# EAGLE design EyeSpark (EAGLE 6.2)
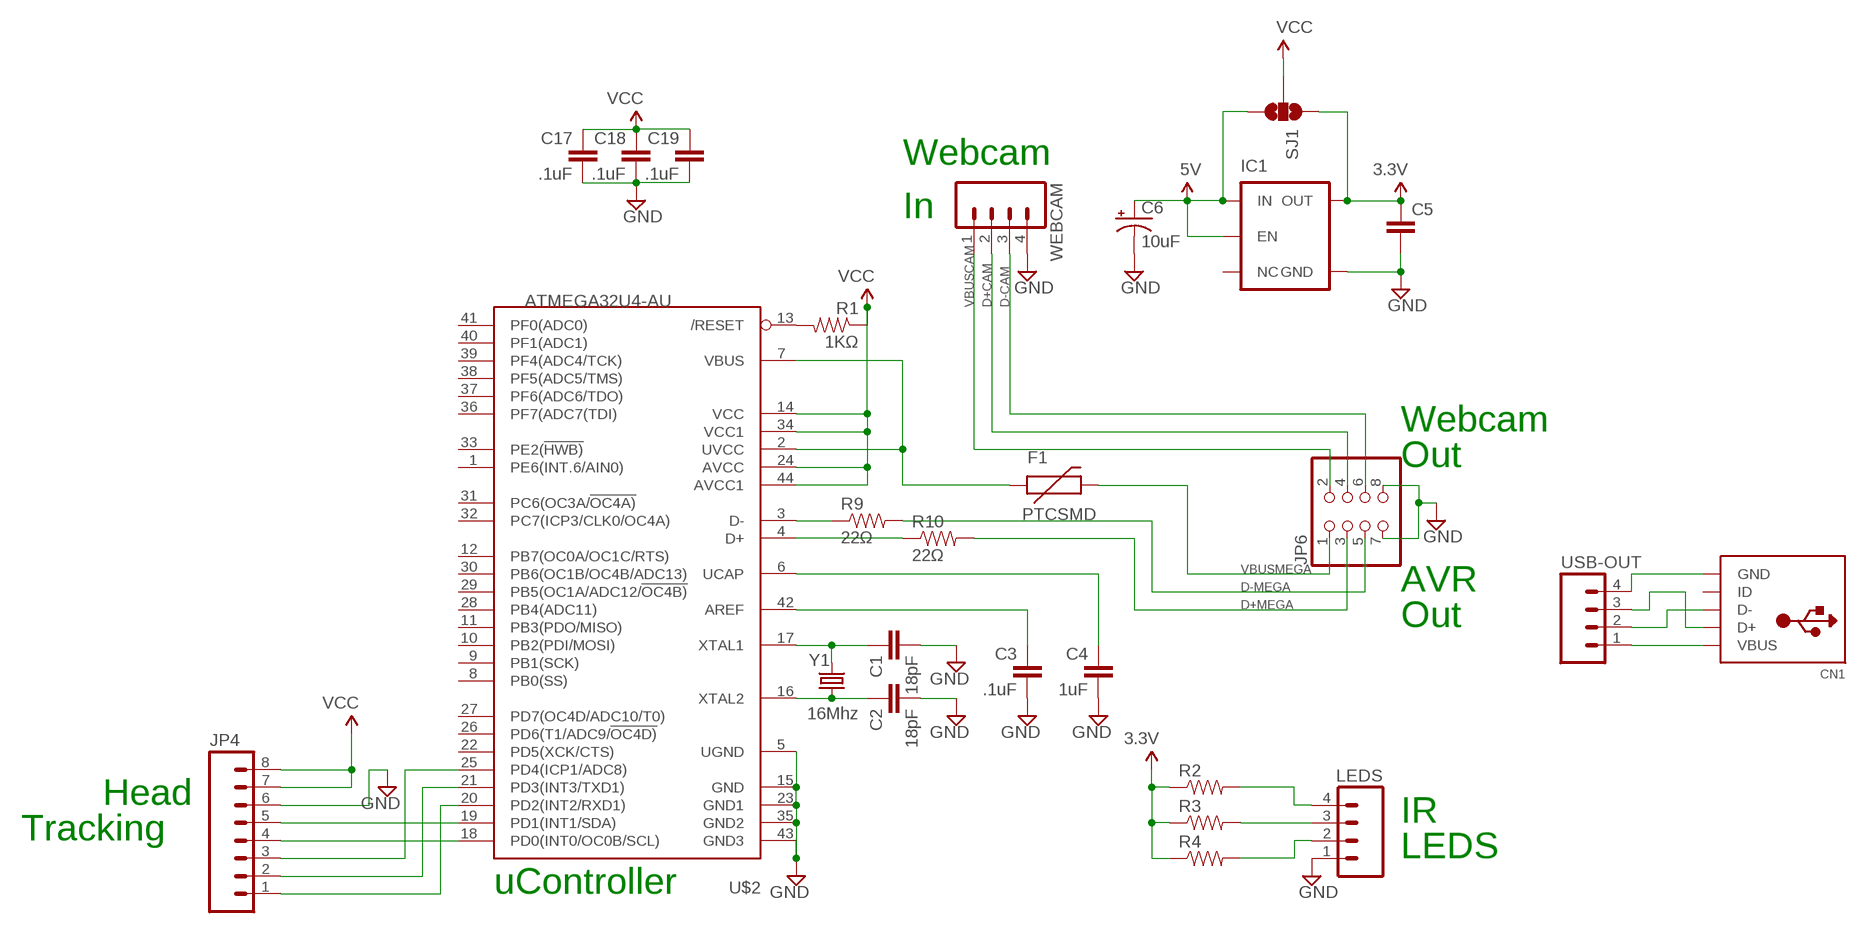
[diagram p0: schematic, sheet 1]

## Parts
C1  18pF  CAP0805  [0805]
C2  18pF  CAP0805  [0805]
C3  .1uF  CAP0805  [0805]
C4  1uF  CAP0805  [0805]
C5  CAP0805  [0805]
C6  10uF  CAP_POL7343  [EIA7343]
C17  .1uF  CAP0805  [0805]
C18  .1uF  CAP0805  [0805]
C19  .1uF  CAP0805  [0805]
CN1  USBMINIB  [USB-MINIB]
F1  PTCSMD  [PTC-1206]
IC1  V_REG_TPS76433SOT23-5  [SOT23-5]
JP4  M08LOCK  [1X08_LOCK]
JP6  PINHD-2X4  [2X04]
LEDS  M04PTH  [1X04]
R1  1KΩ  RESISTOR0805-RES  [0805]
R2  RESISTOR1206  [1206]
R3  RESISTOR1206  [1206]
R4  RESISTOR1206  [1206]
R9  22Ω  RESISTOR0805-RES  [0805]
R10  22Ω  RESISTOR0805-RES  [0805]
SJ1  SOLDERJUMPER_2WAYT  [SJ_2]
U$2  ATMEGA32U4-AU  [TQFP44]
USB-OUT  M04PTH  [1X04]
WEBCAM  M04LOCK_LONGPADS  [1X04_LOCK_LONGPADS]
Y1  16Mhz  CRYSTAL5X3  [CRYSTAL-SMD-5X3]

## Nets
3.3V: C5.1 IC1.5(OUT) R2.1 R3.1 R4.1 SJ1.1
5V: C6.A(+) IC1.1(IN) IC1.3(EN) SJ1.3
D+CAM: JP6.4 WEBCAM.2
D+MEGA: JP6.3 R10.2
D-CAM: JP6.6 WEBCAM.3
D-MEGA: JP6.5 R9.2
GND: C1.2 C2.2 C3.2 C4.2 C5.2 C6.C(-) C17.2 C18.2 C19.2 IC1.2(GND) JP4.6 JP6.7 JP6.8 LEDS.1 U$2.5(UGND) U$2.15(GND) U$2.23(GND1) U$2.35(GND2) U$2.43(GND3) WEBCAM.4
N$1: C3.1 U$2.42(AREF)
N$2: C4.1 U$2.6(UCAP)
N$3: R1.2 U$2.13(/RESET)
N$4: R9.1 U$2.3(D-)
N$5: R10.1 U$2.4(D+)
N$6: JP4.4 U$2.18(PD0(INT0/OC0B/SCL))
N$7: C2.1 U$2.16(XTAL2) Y1.3
N$8: C1.1 U$2.17(XTAL1) Y1.1
N$9: JP4.1 U$2.20(PD2(INT2/RXD1))
N$10: LEDS.4 R2.2
N$11: JP4.2 U$2.21(PD3(INT3/TXD1))
N$12: JP4.5 U$2.19(PD1(INT1/SDA))
N$13: JP4.3 U$2.25(PD4(ICP1/ADC8))
N$14: LEDS.3 R3.2
N$15: F1.1 U$2.2(UVCC) U$2.7(VBUS)
N$16: LEDS.2 R4.2
N$17: CN1.VBUS USB-OUT.1
N$19: CN1.GND USB-OUT.4
N$20: CN1.D- USB-OUT.2
N$21: CN1.D+ USB-OUT.3
VBUSCAM: JP6.2 WEBCAM.1
VBUSMEGA: F1.2 JP6.1
VCC: C17.1 C18.1 C19.1 JP4.7 JP4.8 R1.1 SJ1.2 U$2.14(VCC) U$2.24(AVCC) U$2.34(VCC1) U$2.44(AVCC1)
Unconnected: CN1.ID IC1.4(NC) U$2.1(PE6(INT.6/AIN0)) U$2.8(PB0(SS)) U$2.9(PB1(SCK)) U$2.10(PB2(PDI/MOSI)) U$2.11(PB3(PDO/MISO)) U$2.12(PB7(OC0A/OC1C/RTS)) U$2.22(PD5(XCK/CTS)) U$2.26(PD6(T1/ADC9/!OC4D)) U$2.27(PD7(OC4D/ADC10/T0)) U$2.28(PB4(ADC11)) U$2.29(PB5(OC1A/ADC12/!OC4B)) U$2.30(PB6(OC1B/OC4B/ADC13)) U$2.31(PC6(OC3A/!OC4A)) U$2.32(PC7(ICP3/CLK0/OC4A)) U$2.33(PE2(!HWB)) U$2.36(PF7(ADC7(TDI)) U$2.37(PF6(ADC6/TDO)) U$2.38(PF5(ADC5/TMS)) U$2.39(PF4(ADC4/TCK)) U$2.40(PF1(ADC1)) U$2.41(PF0(ADC0))

## Notes on the sheet
- Webcam
- In
- Webcam
- Out
- AVR
- Out
- Head
- IR
- Tracking
- LEDS
- uController

## Library data of the parts
C1-C5 C17-C19 = SparkFun:CAP: Capacitor Standard 0603 ceramic capacitor, and 0.1" leaded capacitor.
C6 = SparkFun:CAP_POL: Capacitor Polarized These are standard SMD and PTH capacitors. Normally 10uF, 47uF, and 100uF in electrolytic and tantalum varieties. Always verify the external diameter of the through hole cap, it varies with capacity, voltage, and manufacturer. The EIA devices should be standard.
CN1 = adafruit:USB: USB Connectors USBMINIB - Surface Mount Female Mini-B USB Connector 4UConnector: 06564 By microbuilder.eu Thru-hole RA Female Mini-B USB Connector 4UConnector: 18732 By ladyada.net
F1 = SparkFun:PTC: Resettable Fuse PTC Resettable Fuse. Spark Fun Electronics SKU : COM-08357
IC1 = SparkFun:V_REG_TPS76433: Voltage Regulator Older TI part. LDO 150mA regulator. No output by-pass cap option. See V_REG_LDO for a better part.
JP4 = SparkFun:M08: Header 8 Standard 8-pin 0.1" header. Use with straight break away headers (SKU : PRT-00116), right angle break away headers (PRT-00553), swiss pins (PRT-00743), machine pins (PRT-00117), and female headers (PRT-00115).
JP6 = adafruit:PINHD-2X4: PIN HEADER
LEDS USB-OUT WEBCAM = SparkFun:M04: Header 4 Standard 4-pin 0.1" header. Use with straight break away headers (SKU : PRT-00116), right angle break away headers (PRT-00553), swiss pins (PRT-00743), machine pins (PRT-00117), and female headers (PRT-00115). Molex polarized connector foot print use with SKU : PRT-08231 with associated crimp pins and housings. 1MM SMD Version SKU: PRT-10208
R1-R4 R9 R10 = SparkFun:RESISTOR: Resistor Basic schematic elements and footprints for 0603, 1206, and PTH resistors.
SJ1 = SparkFun:SOLDERJUMPER_2WAY: Solder Jumper 2 way solder jumper
U$2 = adafruit:ATMEGA32U4: http://www.ladyada.net/library/eagle
Y1 = SparkFun:CRYSTAL: Crystals Various standard crystals. Proven footprints. Spark Fun Electronics SKU : COM-00534

## Board
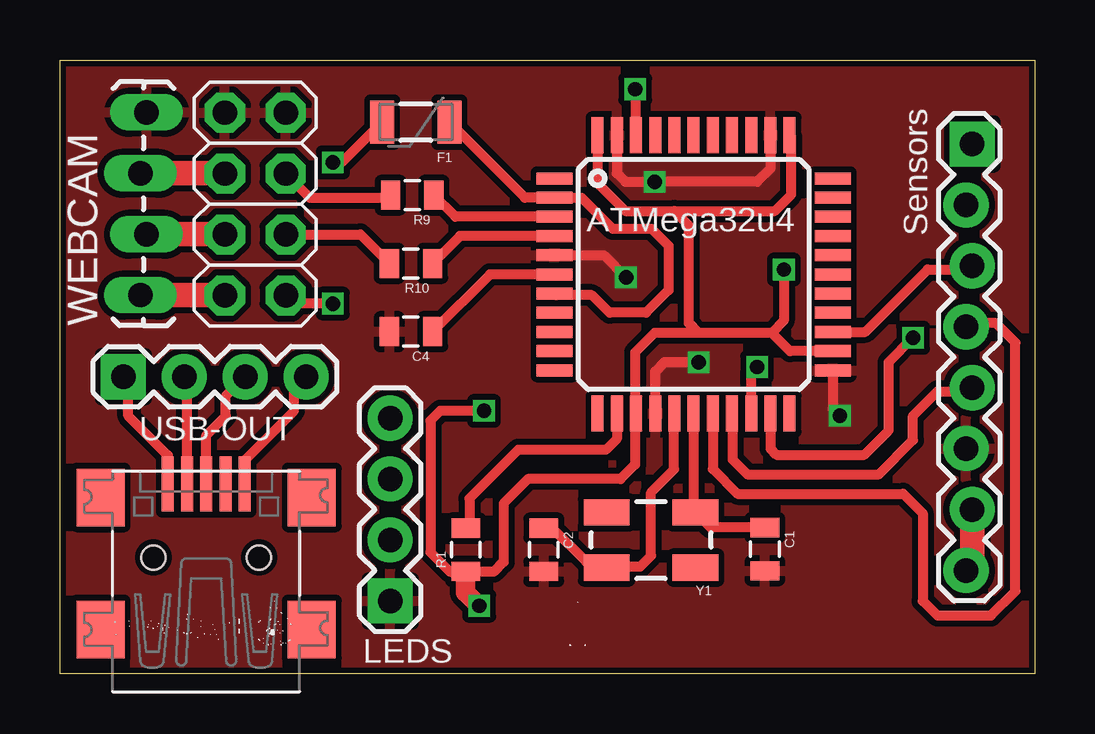
[diagram p1: board, top side]
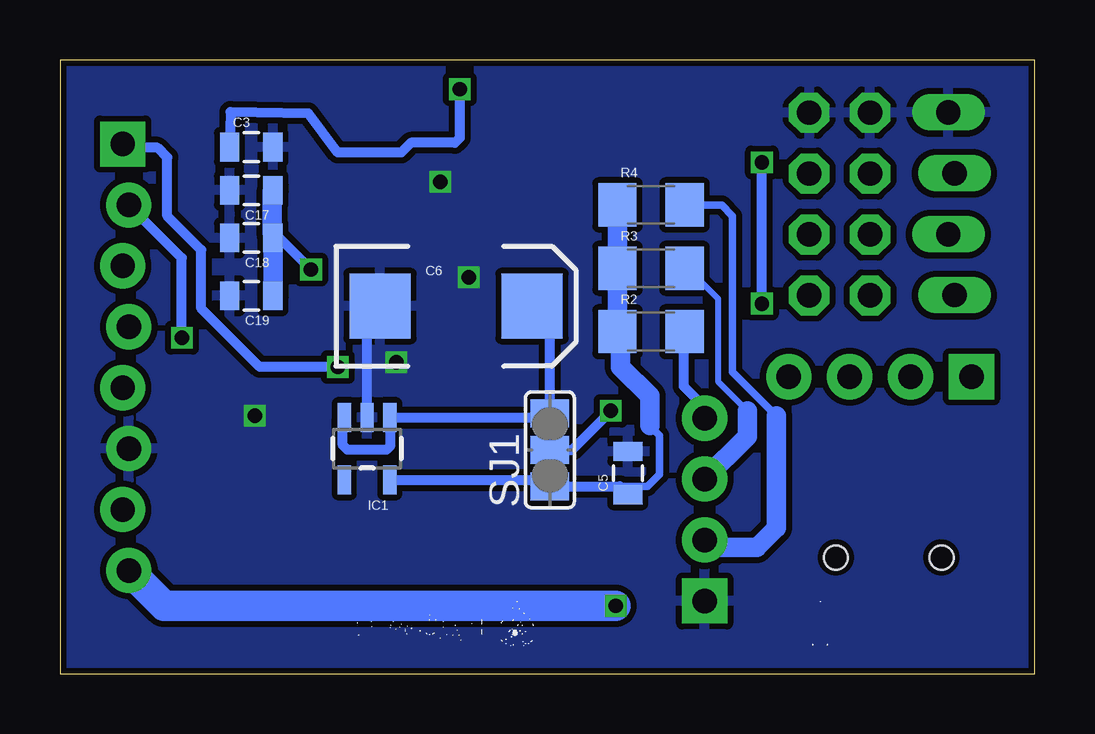
[diagram p2: board, bottom side, seen from below]

Size 40.64 x 25.6 mm. Coordinates in mm from the lower left corner, seen from the top.
Outline: 0,25.6 40.64,25.6 40.64,0 0,0 0,25.6
Copper layers (1*16): Top 0.035mm / dielectric 1.5mm / Bottom 0.035mm
Design rules: minimum track width 6mil, minimum drill 12mil, track to track 6mil, track to pad 6mil, pad to pad 6mil, via to via 6mil, smd to smd 0mil, copper to edge 10mil, drill to drill 10mil, minimum pad ring 10mil, minimum via ring 6mil, stop-mask expansion 2mil, vias tented up to drill 100mil, thermal gap 10mil

### Footprints (pad centres in the part's own frame; a part is rotated, then mirrored left to right if it is on the bottom)
0805 = smd 0.8 x 1.2: 1 -0.9,0; 2 0.9,0
EIA7343 = smd 2.55 x 2.7: A 3.17,0; C -3.17,0
USB-MINIB = smd 0.5 x 2.308: D+ 0,4.064; D- -0.8,4.064; GND 1.6,4.064; ID 0.8,4.064; VBUS -1.6,4.064 | smd 2 x 2.4: GND1 -4.4,-2; GND2 -4.4,3.5; GND3 4.4,3.5; GND4 4.4,-2 | hole 1: -2.2,1; 2.2,1
PTC-1206 = smd 1 x 1.8: 1 -1.4,0; 2 1.4,0
SOT23-5 = smd 0.55 x 1.2: 1 -0.95,-1.3; 2 0,-1.3; 3 0.95,-1.3; 4 0.95,1.3; 5 -0.95,1.3
1X08_LOCK = drill 1.016 pad 1.88 square: 1 0,0.127 | drill 1.016 pad 1.88: 2 2.54,-0.127; 3 5.08,0.127; 4 7.62,-0.127; 5 10.16,0.127; 6 12.7,-0.127; 7 15.24,0.127; 8 17.78,-0.127
2X04 = drill 1.016 pad 1.676 octagon: 1 -3.81,-1.27; 2 -3.81,1.27; 3 -1.27,-1.27; 4 -1.27,1.27; 5 1.27,-1.27; 6 1.27,1.27; 7 3.81,-1.27; 8 3.81,1.27
1X04 = drill 1.016 pad 1.88 square: 1 0,0 | drill 1.016 pad 1.88: 2 2.54,0; 3 5.08,0; 4 7.62,0
1206 = smd 1.6 x 1.8: 1 -1.4,0; 2 1.4,0
SJ_2 = smd 1.168 x 1.6: 1 -1.524,0; 2 0,0; 3 1.524,0
TQFP44 = smd 1.5 x 0.5: 1 -5.8,4; 2 -5.8,3.2; 3 -5.8,2.4; 4 -5.8,1.6; 5 -5.8,0.8; 6 -5.8,0; 7 -5.8,-0.8; 8 -5.8,-1.6; 9 -5.8,-2.4; 10 -5.8,-3.2; 11 -5.8,-4; 23 5.8,-4; 24 5.8,-3.2; 25 5.8,-2.4; 26 5.8,-1.6; 27 5.8,-0.8; 28 5.8,0; 29 5.8,0.8; 30 5.8,1.6; 31 5.8,2.4; 32 5.8,3.2; 33 5.8,4 | smd 0.5 x 1.5: 12 -4,-5.8; 13 -3.2,-5.8; 14 -2.4,-5.8; 15 -1.6,-5.8; 16 -0.8,-5.8; 17 0,-5.8; 18 0.8,-5.8; 19 1.6,-5.8; 20 2.4,-5.8; 21 3.2,-5.8; 22 4,-5.8; 34 4,5.8; 35 3.2,5.8; 36 2.4,5.8; 37 1.6,5.8; 38 0.8,5.8; 39 0,5.8; 40 -0.8,5.8; 41 -1.6,5.8; 42 -2.4,5.8; 43 -3.2,5.8; 44 -4,5.8
1X04_LOCK_LONGPADS = drill 1.016 long: 1 0,0; 2 2.54,-0.254; 3 5.08,0; 4 7.62,-0.254
CRYSTAL-SMD-5X3 = smd 1.9 x 1.1: 1 -1.85,-1.15; 2 1.85,-1.15; 3 1.85,1.15; 4 -1.85,1.15

### Placement (x,y rotation side)
C1  29.39,5.21 270 top
C2  20.17,5.18 270 top
C3  32.66,21.97 0 bottom
C4  14.63,14.27 180 top
C5  16.97,8.38 90 bottom
C6  24.13,15.34 0 bottom
C17  32.66,20.17 180 bottom
C18  32.66,18.19 180 bottom
C19  32.66,15.77 180 bottom
CN1  6.1,3.86 0 top
F1  14.83,23.01 180 top
IC1  27.84,9.4 180 bottom
JP4  37.9,22.1 270 top
JP6  8.14,19.6 90 top
LEDS  13.77,3.05 90 top
R1  16.92,5.18 90 top
R2  16,14.27 0 bottom
R3  16,16.92 0 bottom
R4  16,19.56 0 bottom
R9  14.68,19.96 180 top
R10  14.63,17.12 180 top
SJ1  20.22,9.35 90 bottom
U$2  26.42,16.66 0 top
U$3  [EYESPARK_LOGO]  20.85,1.04 0 top
U$4  [EYESPARK_LOGO]  9.68,1.07 0 bottom
USB-OUT  2.64,12.4 0 top
WEBCAM  3.35,15.8 90 top
Y1  24.64,5.59 180 top

### Tracks (layer width: path | path; a pad name or v marks a point on that pad's centre or on a via)
3.3V
  Bottom 0.305: 17.31,7.82 16.15,7.82 15.65,8.33 15.65,9.96 16.05,10.36
  Bottom 0.406: IC1.5 20.49,8.1 SJ1.1 17.31,7.82 C5.1
  Bottom 0.813: R4.1 R3.1 R2.1 17.27,14.14 17.27,12.8 16.05,11.58 16.05,10.36
5V
  Bottom 0.406: C6.A 20.22,15.82 SJ1.3 20.39,10.7 IC1.1 26.89,9.48 27.03,9.35 28.65,9.35 28.85,9.55 28.85,10.63 IC1.3
D+CAM
  Top 1.016: WEBCAM.2 6.86,18.34 JP6.4
D+MEGA
  Top 0.406: JP6.3 12.53,18.32 R10.2
D-CAM
  Top 1.016: WEBCAM.3 6.86,20.88 JP6.6
D-MEGA
  Top 0.406: R9.2 13.67,19.85 10.43,19.85 JP6.5
GND  (via drill 0.6)
  Top 0.406: U$2.23 32.22,11.07 v32.51,10.77 | U$2.5 22.67,17.46 v23.6,16.54 | U$2.43 23.22,20.88 23.57,20.52 v24.79,20.52 29.06,20.52 29.62,21.08 U$2.35 | U$2.15 24.82,12.62 25.2,13.01 v26.62,13.01
  Bottom 0.406: IC1.2 27.84,16.43 C6.C
  pour Bottom (isolate 0.254): 0,25.6 40.64,25.6 40.64,0 0,0
  pour Top (isolate 0.254): 0,25.6 40.64,25.6 40.64,0 0,0
N$1  (via drill 0.6)
  Top 0.406: U$2.42 24.02,24.35 v23.98,24.38
  Bottom 0.406: v23.98,24.38 23.98,22.35 24.18,22.15 26.01,22.15 26.42,21.74 29.06,21.74 30.28,23.37 33.53,23.43 C3.1
N$2
  Top 0.406: U$2.6 17.92,16.66 C4.1
N$3
  Top 0.406: U$2.13 23.22,9.8 22.76,9.35 19.1,9.35 17.07,7.32 17.07,6.23 R1.2
N$4
  Top 0.406: U$2.3 16.48,19.06 R9.1
N$5
  Top 0.406: U$2.4 16.67,18.26 R10.1
N$6
  Top 0.406: U$2.18 27.22,8.55 28.25,7.52 35.15,7.52 35.97,6.71 35.97,3.05 36.58,2.44 38.81,2.44 39.83,3.45 39.83,13.82 39.01,14.63 37.92,14.63 JP4.4
N$7
  Top 0.406: U$2.16 25.6,10.85 25.6,8.53 24.64,7.57 24.64,4.93 24.18,4.47 22.82,4.47 Y1.3 22.55,4.67 21.95,4.67 20.54,6.08 C2.1
N$8
  Top 0.406: U$2.17 26.42,6.81 Y1.1 27.12,6.11 C1.1
N$9  (via drill 0.6)
  Top 0.406: U$2.20 28.82,12.56 v29.06,12.8
  Bottom 0.406: v29.06,12.8 32.31,12.8 34.75,15.24 34.75,17.68 36.17,19.1 36.17,21.54 36.58,21.95 37.87,21.95 JP4.1
N$10
  Bottom 0.406: LEDS.4 13.77,11.12 14.63,11.99 14.63,14.25 R2.2
N$11  (via drill 0.6)
  Top 0.406: U$2.21 29.62,9.4 29.87,9.14 33.53,9.14 34.54,10.16 34.54,13.01 v35.56,14.02
  Bottom 0.406: v35.56,14.02 35.56,17.35 JP4.2
N$12
  Top 0.406: U$2.19 28.04,10.84 28.04,8.94 28.65,8.33 34.14,8.33 35.56,9.75 35.56,10.77 36.58,11.79 37.87,11.79 JP4.5
N$13
  Top 0.406: U$2.25 33.57,14.26 36.17,16.87 37.87,16.87 JP4.3
N$14
  Bottom 0.254: R3.2 14.48,16.92 13.21,15.65 13.21,12.19 11.99,10.97
  Bottom 0.813: 11.99,10.97 11.99,9.91 LEDS.3
N$15
  Top 0.406: U$2.7 20.68,15.8 22.17,15.8 22.91,15.06 24.43,15.06 25.38,16 25.38,17.86 24.66,18.57 23.04,18.57 21.74,19.86 U$2.2 19.38,19.86 F1.1
N$16
  Bottom 0.305: R4.2 13.06,19.56 12.6,19.1 12.6,12.6 10.77,10.77
  Bottom 0.813: 10.77,10.77 10.77,6.1 11.58,5.28 13.46,5.28 LEDS.2
N$17
  Top 0.406: CN1.VBUS 4.5,9.12 2.85,10.77 2.85,12.19 USB-OUT.1
N$19
  Top 0.406: CN1.GND 7.7,8.91 9.75,10.97 9.75,11.89 USB-OUT.4
N$20
  Top 0.406: CN1.D- 5.3,12.28 USB-OUT.2
N$21
  Top 0.406: CN1.D+ 6.1,9.96 6.91,10.77 6.91,11.58 USB-OUT.3
VBUSCAM
  Top 1.016: WEBCAM.1 6.86,15.8 JP6.2
VBUSMEGA  (via drill 0.6)
  Top 0.406: v11.38,21.34 11.79,21.36 F1.2 | v11.38,15.44 9.75,15.44 JP6.1
  Bottom 0.406: v11.38,15.44 v11.38,21.34
VCC  (via drill 0.6)
  Top 0.406: U$2.44 22.42,20.46 23.57,19.3 25.6,19.3 | 25.6,19.3 29.79,19.3 30.48,19.99 30.48,22.4 U$2.34 | U$2.24 30.43,13.46 29.67,14.22 | 26.62,14.22 24.79,14.22 23.98,13.41 23.98,10.9 | 23.98,10.9 U$2.14 | 29.67,14.22 26.62,14.22 | 26.62,14.22 26.21,14.63 26.21,18.69 25.6,19.3 | 23.98,10.9 23.98,8.74 23.37,8.13 19.51,8.13 18.49,7.11 18.49,4.67 18.09,4.27 16.93,4.27 R1.1 16.9,4.27 16.26,4.27 15.44,5.08 15.44,10.57 15.85,10.97 v17.68,10.97 | v30.18,16.87 30.18,14.73 29.67,14.22
  Top 0.813: R1.1 16.92,3.4 v17.48,2.85
  Top 1.016: JP4.7 38.02,4.57 JP4.8
  Bottom 0.406: SJ1.2 19.3,9.35 v17.68,10.97 | 31.76,20.33 31.76,18.45 v30.18,16.87
  Bottom 0.813: C19.1 C18.1 31.8,18.43 31.8,20.09 31.76,20.33 C17.1
  Bottom 1.27: v17.48,2.85 36.3,2.85 JP4.8

### Text on the board
tNames: Sensors | ATMega32u4 | USB-OUT | LEDS